# Altium project RPI GPIO BOARD.PrjPcb
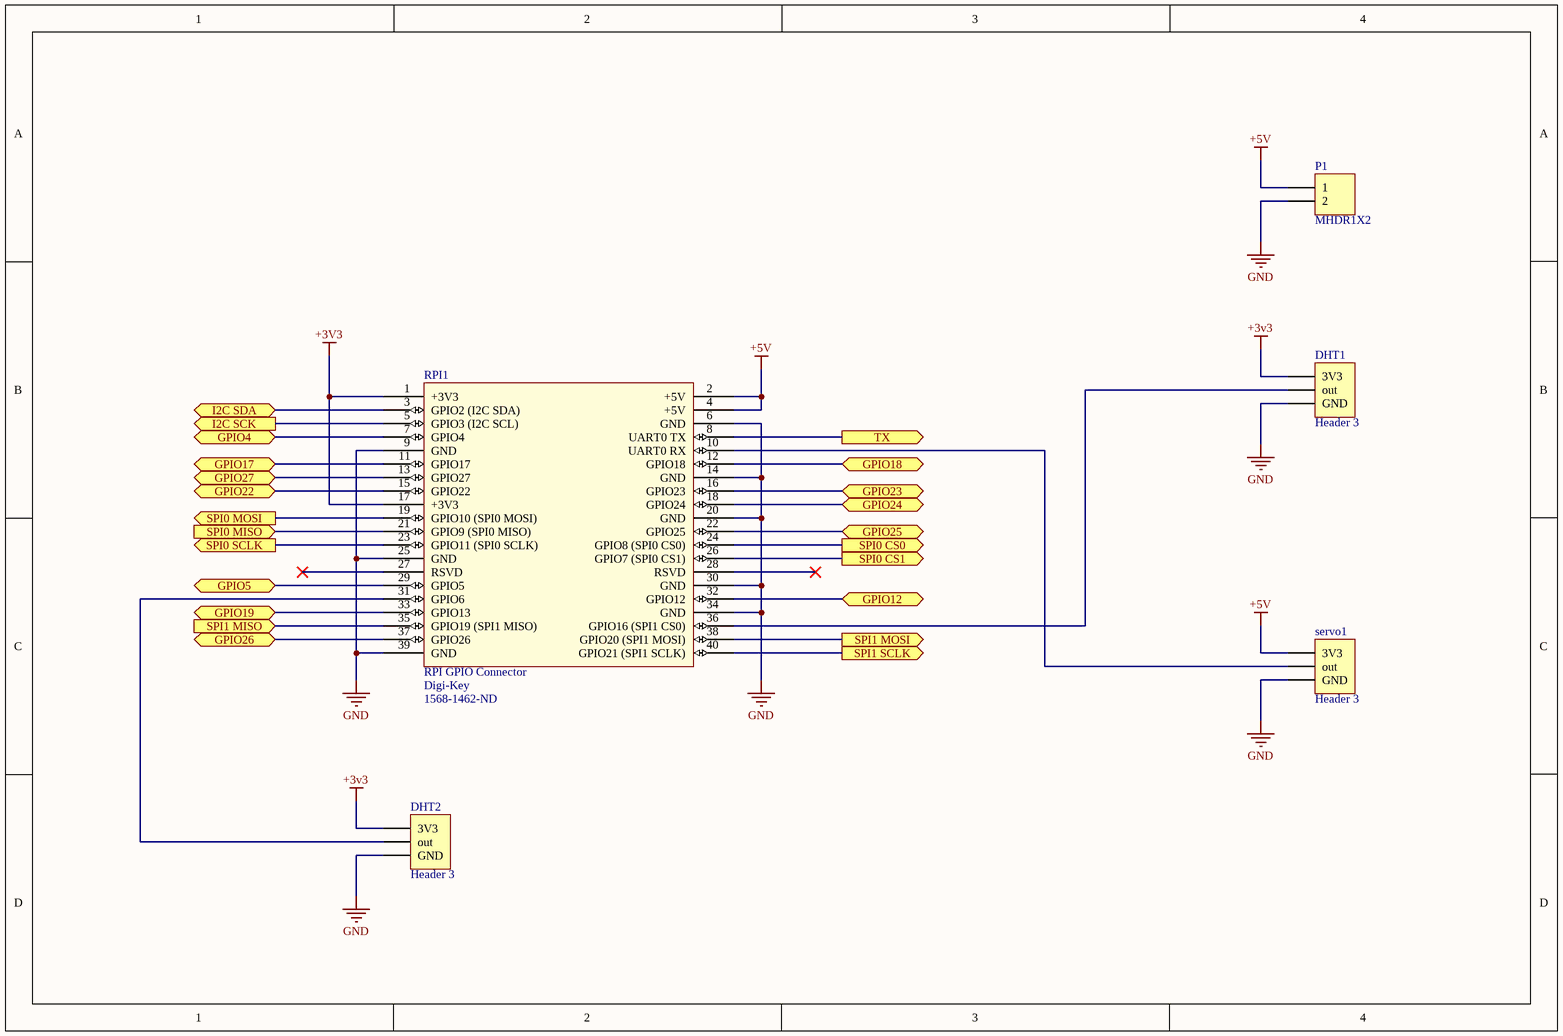
[diagram p0: RPI 3.SchDoc]
mProjectVersion: 1; mProjectRevision: 0; mProjectName: RPI BOARD; mProjectAuthor: Nils Minor
2 sheets, 23 parts. Net scope: flat (ports and power ports of the same name join across sheets).
Board file: RPI 3_pour.PcbDoc
Sheets:
  RPI 3.SchDoc
  ADC.SchDoc

## Sheet RPI 3.SchDoc
size A4; DocumentNumber: 1; SheetNumber: 1; SheetTotal: 1

### Parts
DHT1  Header 3  [HDR1X3]
DHT2  Header 3  [HDR1X3]
P1  MHDR1X2  [MHDR1X2]
RPI1  RPI GPIO Connector  Supplier 1: Digi-Key  Supplier Part Number 1: 1568-1462-ND  [rpi]
servo1  Header 3  [HDR1X3]

### Ports
GPIO4 (bidir), GPIO5 (bidir), GPIO12 (bidir), GPIO17 (bidir), GPIO18 (bidir), GPIO19 (bidir), GPIO22 (bidir), GPIO23 (bidir), GPIO24 (bidir), GPIO25 (bidir), GPIO26 (bidir), GPIO27 (bidir), I2C SCK (out), I2C SDA (bidir), SPI0 CS0 (out), SPI0 CS1 (out), SPI0 MISO (in), SPI0 MOSI (out), SPI0 SCLK (out), SPI1 MISO (in), SPI1 MOSI (out), SPI1 SCLK (out), TX (out)

### Nets
+3V3: DHT1.1(3V3) DHT2.1(3V3) RPI1.1(+3V3) RPI1.17(+3V3)
+5V: P1.1 RPI1.2(+5V) RPI1.4(+5V) servo1.1(3V3)
GND: DHT1.3(GND) DHT2.3(GND) P1.2 RPI1.6(GND) RPI1.9(GND) RPI1.14(GND) RPI1.20(GND) RPI1.25(GND) RPI1.30(GND) RPI1.34(GND) RPI1.39(GND) servo1.3(GND)
NetDHT1_2: DHT1.2(out) RPI1.36(GPIO16_(SPI1_CS0))
NetDHT2_2: DHT2.2(out) RPI1.31(GPIO6)
NetRPI1_3: RPI1.3(GPIO2_(I2C_SDA)) ; port I2C SDA
NetRPI1_5: RPI1.5(GPIO3_(I2C_SCL)) ; port I2C SCK
NetRPI1_7: RPI1.7(GPIO4) ; port GPIO4
NetRPI1_8: RPI1.8(UART0_TX) ; port TX
NetRPI1_10: RPI1.10(UART0_RX) servo1.2(out)
NetRPI1_11: RPI1.11(GPIO17) ; port GPIO17
NetRPI1_12: RPI1.12(GPIO18) ; port GPIO18
NetRPI1_13: RPI1.13(GPIO27) ; port GPIO27
NetRPI1_15: RPI1.15(GPIO22) ; port GPIO22
NetRPI1_16: RPI1.16(GPIO23) ; port GPIO23
NetRPI1_18: RPI1.18(GPIO24) ; port GPIO24
NetRPI1_19: RPI1.19(GPIO10_(SPI0_MOSI)) ; port SPI0 MOSI
NetRPI1_21: RPI1.21(GPIO9_(SPI0_MISO)) ; port SPI0 MISO
NetRPI1_22: RPI1.22(GPIO25) ; port GPIO25
NetRPI1_23: RPI1.23(GPIO11_(SPI0_SCLK)) ; port SPI0 SCLK
NetRPI1_24: RPI1.24(GPIO8_(SPI0_CS0)) ; port SPI0 CS0
NetRPI1_26: RPI1.26(GPIO7_(SPI0_CS1)) ; port SPI0 CS1
NetRPI1_29: RPI1.29(GPIO5) ; port GPIO5
NetRPI1_32: RPI1.32(GPIO12) ; port GPIO12
NetRPI1_33: RPI1.33(GPIO13) ; port GPIO19
NetRPI1_35: RPI1.35(GPIO19_(SPI1_MISO)) ; port SPI1 MISO
NetRPI1_37: RPI1.37(GPIO26) ; port GPIO26
NetRPI1_38: RPI1.38(GPIO20_(SPI1_MOSI)) ; port SPI1 MOSI
NetRPI1_40: RPI1.40(GPIO21_(SPI1_SCLK)) ; port SPI1 SCLK

Not connected (* = marked no-connect by the designer): RPI1 27(RSVD)* 28(RSVD)*

### Library data of the parts
DHT1 DHT2 servo1 = Header 3: Header, 3-Pin; LatestRevisionDate: 17-Jul-2002; LatestRevisionNote: Re-released for DXP Platform.; Publisher: Altium Limited
P1 = MHDR1X2: Header, 2-Pin; LatestRevisionDate: 17-Jul-2002; LatestRevisionNote: Re-released for DXP Platform.; Publisher: Altium Limited
RPI1 = rpi connector: GPIO Header for Raspberry Pi A+/B+/Pi 2/Pi 3 - 2x20; Manufacturer: SparkFun Electronics; Manufacturer Part Number: PRT-14017; Nils Minor: author; nilsminor@web.de: mail; RoHS: RoHS Compliant; Category: Development Boards, Kits, Programmers; Stock 1: 150; Pricing 1: 1=1.84 (EUR); Part Status: Active; Accessory Type: Connector; For Use With/Related Products: Raspberry Pi; ComponentLink1URL: https://cdn.sparkfun.com/datasheets/Dev/RaspberryPi/12313.pdf; ComponentLink1Description: https://cdn.sparkfun.com/datasheets/Dev/RaspberryPi/12313.pdf

## Sheet ADC.SchDoc
size A4
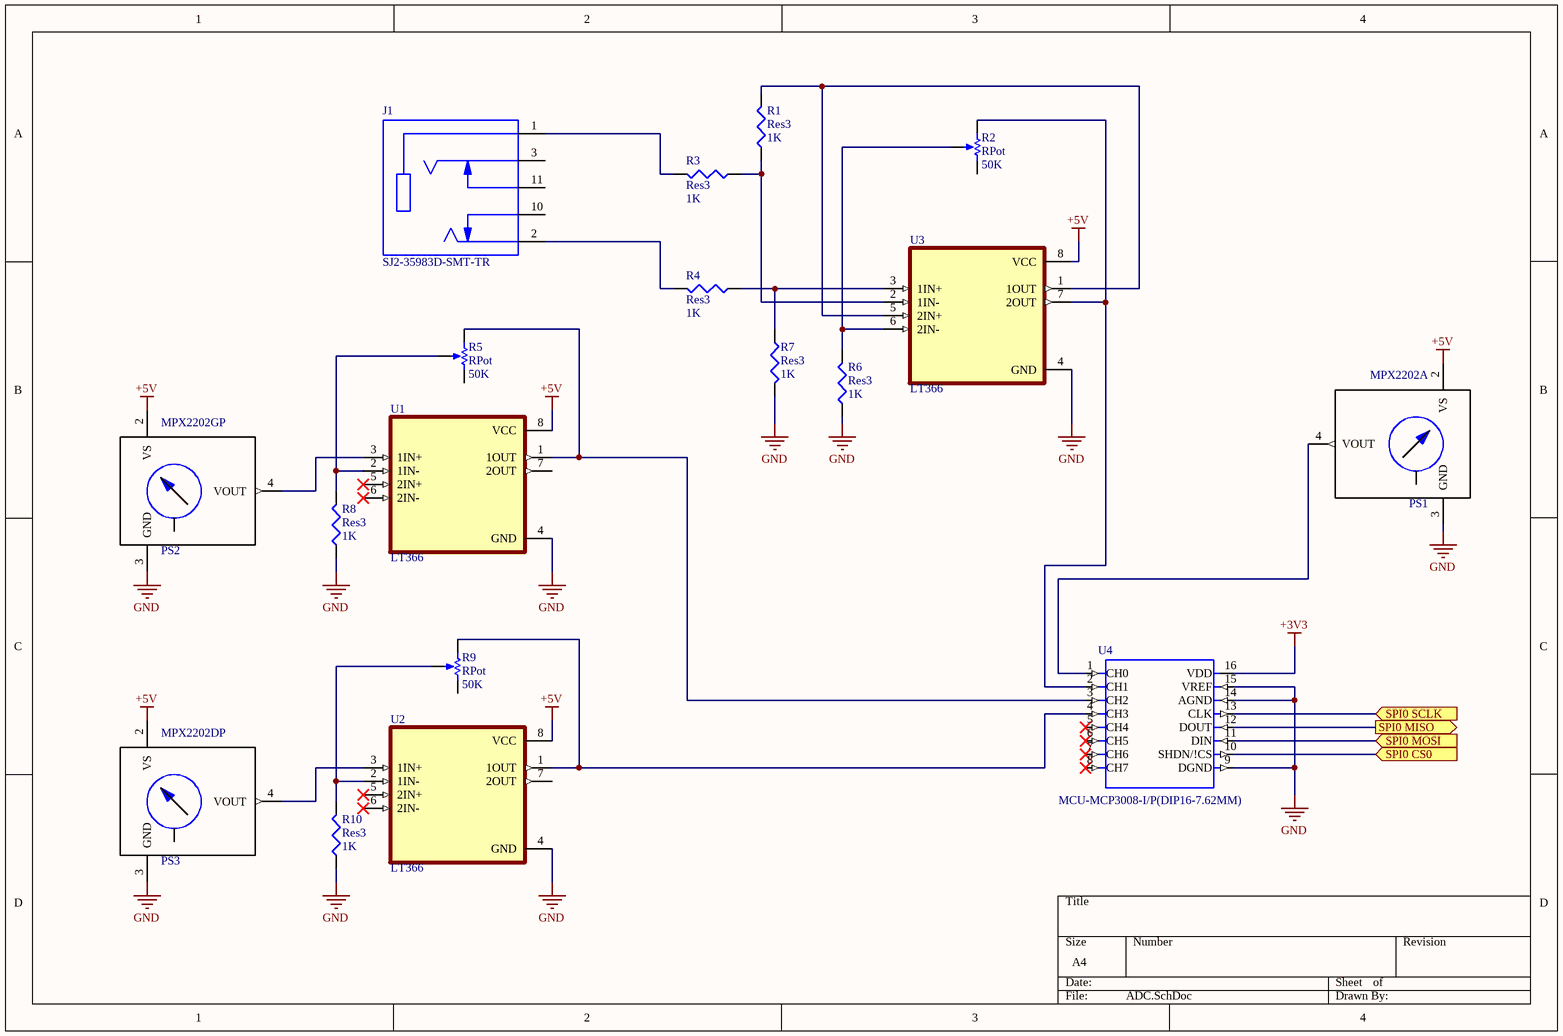
[diagram p1: ADC.SchDoc]

### Parts
J1  SJ2-35983D-SMT-TR  [CUI_SJ2-35983D-SMT-TR]
PS1  MPX2202A  [*867-V]
PS2  MPX2202GP  [*867B-V]
PS3  MPX2202DP  [*867C-V]
R1  Res3  value 1K  [J1-0603]
R2  RPot  value 50K  [VR5]
R3  Res3  value 1K  [J1-0603]
R4  Res3  value 1K  [J1-0603]
R5  RPot  value 50K  [VR5]
R6  Res3  value 1K  [J1-0603]
R7  Res3  value 1K  [J1-0603]
R8  Res3  value 1K  [J1-0603]
R9  RPot  value 50K  [VR5]
R10  Res3  value 1K  [J1-0603]
U1  LT366  [DIP-8]
U2  LT366  [DIP-8]
U3  LT366  [DIP-8]
U4  MCU-MCP3008-I/P(DIP16-7.62MM)  [DIP16-2.54-19.2X7.62MM]

### Ports
SPI0 CS0 (in), SPI0 MISO (out), SPI0 MOSI (in), SPI0 SCLK (in)

### Nets
+3V3: U4.16(VDD)
+5V: PS1.2(VS) PS2.2(VS) PS3.2(VS) U1.8(VCC) U2.8(VCC) U3.8(VCC)
GND: PS1.3(GND) PS2.3(GND) PS3.3(GND) R6.1 R7.2 R8.1 R10.1 U1.4(GND) U2.4(GND) U3.4(GND) U4.9(DGND) U4.14(AGND) U4.15(VREF)
NetJ1_1: J1.1(SLEEVE) R3.2
NetJ1_2: J1.2(TIP) R4.2
NetPS1_4: PS1.4(VOUT) U4.1(CH0)
NetPS2_4: PS2.4(VOUT) U1.3(1IN+)
NetPS3_4: PS3.4(VOUT) U2.3(1IN+)
NetR1_1: R1.1 R3.1 U3.2(1IN-)
NetR1_2: R1.2 U3.1(1OUT) U3.5(2IN+)
NetR2_1: R2.1(TOP) U3.7(2OUT) U4.2(CH1)
NetR2_3: R2.3(TAP) R6.2 U3.6(2IN-)
NetR4_1: R4.1 R7.1 U3.3(1IN+)
NetR5_1: R5.1(TOP) U1.1(1OUT) U4.3(CH2)
NetR5_3: R5.3(TAP) R8.2 U1.2(1IN-)
NetR9_1: R9.1(TOP) U2.1(1OUT) U4.4(CH3)
NetR9_3: R9.3(TAP) R10.2 U2.2(1IN-)
NetRPI1_19: U4.11(DIN) ; port SPI0 MOSI
NetRPI1_21: U4.12(DOUT) ; port SPI0 MISO
NetRPI1_23: U4.13(CLK) ; port SPI0 SCLK
NetRPI1_24: U4.10(SHDN/!CS) ; port SPI0 CS0

Not connected (* = marked no-connect by the designer): J1 3(RING1) 10(TIP_SWITCH) 11(RING1_SWITCH); PS1 1(NC@1) 5(NC@5) 6(NC@6); PS2 1(NC@1) 5(NC@5) 6(NC@6); PS3 1(NC@1) 5(NC@5) 6(NC@6); R2 2(BOT); R5 2(BOT); R9 2(BOT); U1 5(2IN+)* 6(2IN-)* 7(2OUT); U2 5(2IN+)* 6(2IN-)* 7(2OUT); U4 5(CH4)* 6(CH5)* 7(CH6)* 8(CH7)*

### Library data of the parts
J1 = SJ2-35983D-SMT-TR: 3 conductor, 3.5 mm, SMT Audio Jack w/ 2 switch; Package: None; Price: None; Value: *; MP: SJ2-35983D-SMT-TR; Availability: Unavailable
PS1-PS3 = MPX*****: Low-Side Gate Driver IC Inverting, Non-Inverting 6-MLP (2x2); MP: MPX; MF: ON Semiconductor; Package: SOT-223-4 Texas Instruments; Availability: Bad; Check_prices: https://www.snapeda.com/parts/MPX/ON%20Semiconductor/view-part/121742/?ref=eda; SnapEDA_Link: https://www.snapeda.com/parts/MPX/ON%20Semiconductor/view-part/121742/?ref=snap; Price: None; Value: *
R1 R3 R4 R6-R8 R10 = Res3: Resistor; Published: 8-Jun-2000; LatestRevisionDate: 29-May-2009; LatestRevisionNote: IPC-7351 Footprint Added.; PackageReference: J1-0603; Publisher: Altium Limited; PackageDescription: Chip Resistor
R2 R5 R9 = RPot: Potentiometer; Sim Note: Enter the Resistance value and the set point into parameter fields.; Set Position: 0.5; Published: 8-Jun-2000; LatestRevisionDate: 17-Jul-2002; LatestRevisionNote: Re-released for DXP Platform.; PackageReference: VR5; Publisher: Altium Limited; PackageDescription: Variable Resistor, Thru-Hole; 3 Leads
U1-U3 = LM358P: Dual Operational Amplifiers; MF: Texas Instruments; Package: PDIP-8 Texas Instruments; DigiKey-Purchase-URL: https://snapeda.com/shop?store=DigiKey&id=559457; MP: LM358P; Arrow_Electronics-Purchase-URL: https://snapeda.com/shop?store=Arrow+Electronics&id=559457; Price: None; Texas_Instruments-Purchase-URL: https://snapeda.com/shop?store=Texas+Instruments&id=559457; Value: *; Availability: Unavailable; SnapEDA_Link: https://www.snapeda.com/parts/LM358P/Texas%20Instruments/view-part/559457/?ref=snap; Mouser-Purchase-URL: https://snapeda.com/shop?store=Mouser&id=559457
U4 = MCU-MCP3008-I/P(DIP16-7.62MM): 10 Bit Analog to Digital Converter 4, 8 Input 1 SAR 16-PDIP; MF: Microchip; Package: DIP-16 Microchip; Value: *; Availability: Unavailable; SnapEDA_Link: https://www.snapeda.com/parts/MCP3008-I/P/Microchip/view-part/43628/?ref=snap; Price: None; MP: MCP3008-I/P

## Nets that join several sheets
+3V3: RPI 3 (DHT1.1 DHT2.1 RPI1.1 RPI1.17), ADC (U4.16)
+5V: RPI 3 (P1.1 RPI1.2 RPI1.4 servo1.1), ADC (6 pins)
GND: RPI 3 (12 pins), ADC (13 pins)
NetRPI1_19: RPI 3 (RPI1.19), ADC (U4.11)
NetRPI1_21: RPI 3 (RPI1.21), ADC (U4.12)
NetRPI1_23: RPI 3 (RPI1.23), ADC (U4.13)
NetRPI1_24: RPI 3 (RPI1.24), ADC (U4.10)

## Assembly variants
default: all parts fitted